# EAGLE schematic untitled (EAGLE 9.6.2)
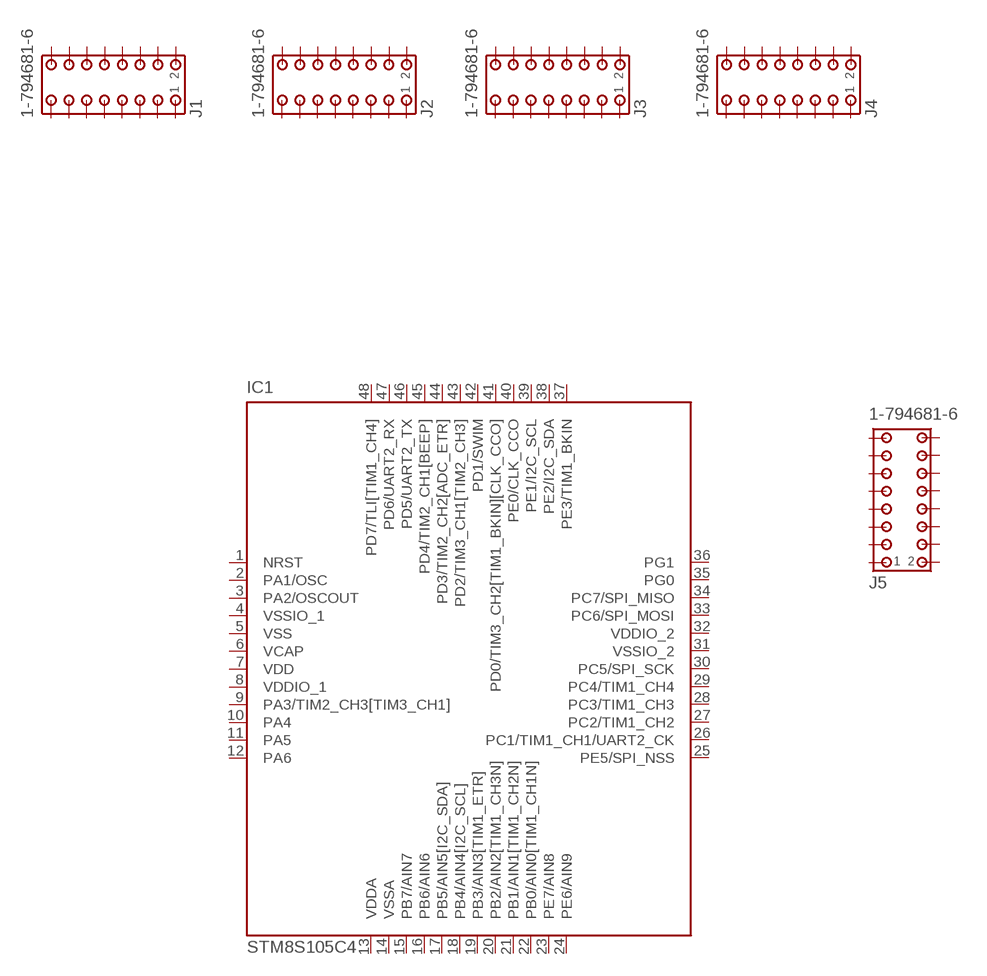
[diagram p0: schematic, sheet 1]

## Parts
IC1  STM8S105C4  [LQFP48-7X7]
J1  1-794681-6  [1-794681-6]
J2  1-794681-6  [1-794681-6]
J3  1-794681-6  [1-794681-6]
J4  1-794681-6  [1-794681-6]
J5  1-794681-6  [1-794681-6]
Unconnected: IC1.1(NRST) IC1.2(PA1/OSC) IC1.3(PA2/OSCOUT) IC1.9(PA3/TIM2_CH3[TIM3_CH1]) IC1.10(PA4) IC1.11(PA5) IC1.12(PA6) IC1.15(PB7/AIN7) IC1.16(PB6/AIN6) IC1.17(PB5/AIN5[I2C_SDA]) IC1.18(PB4/AIN4[I2C_SCL]) IC1.19(PB3/AIN3[TIM1_ETR]) IC1.20(PB2/AIN2[TIM1_CH3N]) IC1.21(PB1/AIN1[TIM1_CH2N]) IC1.22(PB0/AIN0[TIM1_CH1N]) IC1.23(PE7/AIN8) IC1.24(PE6/AIN9) IC1.25(PE5/SPI_NSS) IC1.26(PC1/TIM1_CH1/UART2_CK) IC1.27(PC2/TIM1_CH2) IC1.28(PC3/TIM1_CH3) IC1.29(PC4/TIM1_CH4) IC1.30(PC5/SPI_SCK) IC1.33(PC6/SPI_MOSI) IC1.34(PC7/SPI_MISO) IC1.35(PG0) IC1.36(PG1) IC1.37(PE3/TIM1_BKIN) IC1.38(PE2/I2C_SDA) IC1.39(PE1/I2C_SCL) IC1.40(PE0/CLK_CCO) IC1.41(PD0/TIM3_CH2[TIM1_BKIN][CLK_CCO]) IC1.42(PD1/SWIM) IC1.43(PD2/TIM3_CH1[TIM2_CH3]) IC1.44(PD3/TIM2_CH2[ADC_ETR]) IC1.45(PD4/TIM2_CH1[BEEP]) IC1.46(PD5/UART2_TX) IC1.47(PD6/UART2_RX) IC1.48(PD7/TLI[TIM1_CH4]) J1.1 J1.2 J1.3 J1.4 J1.5 J1.6 J1.7 J1.8 J1.9 J1.10 J1.11 J1.12 J1.13 J1.14 J1.15 J1.16 J2.1 J2.2 J2.3 J2.4 J2.5 J2.6 J2.7 J2.8 J2.9 J2.10 J2.11 J2.12 J2.13 J2.14 J2.15 J2.16 J3.1 J3.2 J3.3 J3.4 J3.5 J3.6 J3.7 J3.8 J3.9 J3.10 J3.11 J3.12 J3.13 J3.14 J3.15 J3.16 J4.1 J4.2 J4.3 J4.4 J4.5 J4.6 J4.7 J4.8 J4.9 J4.10 J4.11 J4.12 J4.13 J4.14 J4.15 J4.16 J5.1 J5.2 J5.3 J5.4 J5.5 J5.6 J5.7 J5.8 J5.9 J5.10 J5.11 J5.12 J5.13 J5.14 J5.15 J5.16

## Power pins joined to a net without a drawn wire
VCAP: IC1.6(VCAP)
VDD: IC1.7(VDD)
VDDA: IC1.13(VDDA)
VDDIO_1: IC1.8(VDDIO_1)
VDDIO_2: IC1.32(VDDIO_2)
VSS: IC1.5(VSS)
VSSA: IC1.14(VSSA)
VSSIO_1: IC1.4(VSSIO_1)
VSSIO_2: IC1.31(VSSIO_2)

## Library data of the parts
IC1 = st-microelectronics:STM8S105C: Access line, 16 MHz STM8S 8-bit MCU up to 32 Kbytes Flash, integrated EEPROM,10-bit ADC, timers, UART, SPI, I²C Source: Data sheet <http://www.st.com/stonline/products/literature/ds/14771/stm8s105c4.pdf>; MPN: STM8S105C4T6; OC_FARNELL: 1706221; OC_NEWARK: 09R6031
J1-J5 = con-amp:1-794681-6: Micro MATE-N-LOK Connectors grid 1.5mm Dual Row Through Hole Vertical Metal Through Hole Holddowns Source: ENG_CD_794681_E.pdf